# EAGLE design TinyCube11c_Lib (EAGLE 7.5.0)
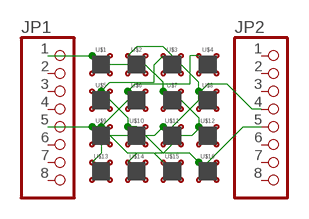
[diagram p0: schematic, sheet 1]

## Parts
JP1  PINHD-1X8BIG  [1X08-BIG]
JP2  PINHD-1X8BIG  [1X08-BIG]
U$1  PILLAR  [10MIL]
U$2  PILLAR  [10MIL]
U$3  PILLAR  [10MIL]
U$4  PILLAR  [10MIL]
U$5  PILLAR  [10MIL]
U$6  PILLAR  [10MIL]
U$7  PILLAR  [10MIL]
U$8  PILLAR  [10MIL]
U$9  PILLAR  [10MIL]
U$10  PILLAR  [10MIL]
U$11  PILLAR  [10MIL]
U$12  PILLAR  [10MIL]
U$13  PILLAR  [10MIL]
U$14  PILLAR  [10MIL]
U$15  PILLAR  [10MIL]
U$16  PILLAR  [10MIL]

## Nets
N$1: JP1.1 U$1.R(B) U$7.R(B) U$12.R(B) U$14.R(B)
N$2: JP2.4 U$2.R(B) U$8.R(B) U$11.R(B) U$13.R(B)
N$3: JP2.5 U$3.R(B) U$5.R(B) U$10.R(B) U$16.R(B)
N$5: JP1.5 U$4.R(B) U$6.R(B) U$9.R(B) U$15.R(B)
Unconnected: JP1.2 JP1.3 JP1.4 JP1.6 JP1.7 JP1.8 JP2.1 JP2.2 JP2.3 JP2.6 JP2.7 JP2.8 U$1.+(G) U$1.B(R) U$1.G(A) U$2.+(G) U$2.B(R) U$2.G(A) U$3.+(G) U$3.B(R) U$3.G(A) U$4.+(G) U$4.B(R) U$4.G(A) U$5.+(G) U$5.B(R) U$5.G(A) U$6.+(G) U$6.B(R) U$6.G(A) U$7.+(G) U$7.B(R) U$7.G(A) U$8.+(G) U$8.B(R) U$8.G(A) U$9.+(G) U$9.B(R) U$9.G(A) U$10.+(G) U$10.B(R) U$10.G(A) U$11.+(G) U$11.B(R) U$11.G(A) U$12.+(G) U$12.B(R) U$12.G(A) U$13.+(G) U$13.B(R) U$13.G(A) U$14.+(G) U$14.B(R) U$14.G(A) U$15.+(G) U$15.B(R) U$15.G(A) U$16.+(G) U$16.B(R) U$16.G(A)

## Library data of the parts
JP1 JP2 = adafruit:PINHD-1X8: PIN HEADER
U$1-U$16 = PILLAR:PILLAR

## Board
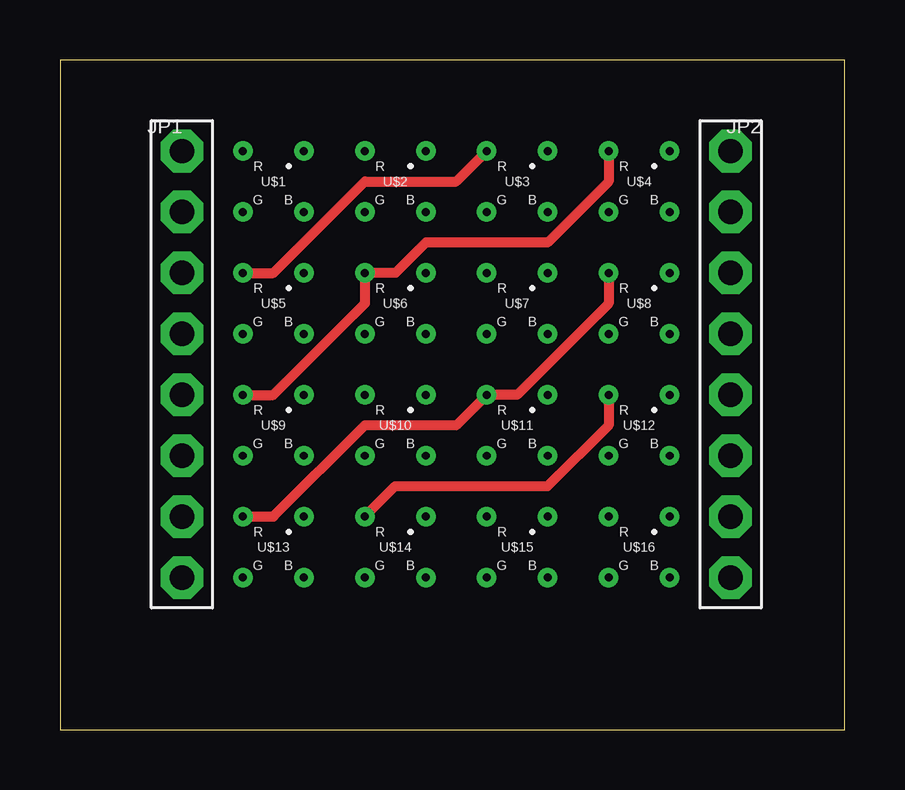
[diagram p1: board, top side]
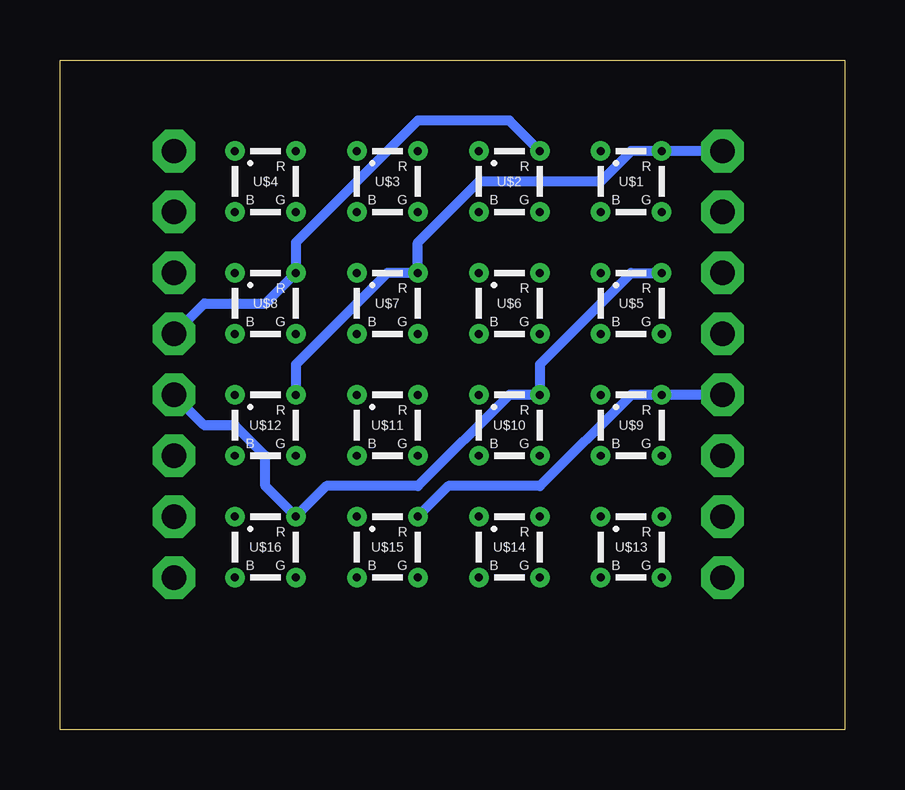
[diagram p2: board, bottom side, seen from below]

Size 32.69 x 27.93 mm. Coordinates in mm from the lower left corner, seen from the top.
Outline: 0,0 32.69,0 32.69,27.93 0,27.93 0,0
Copper layers (1*16): Top 0.0356mm / dielectric 1.5011mm / Bottom 0.0356mm
Design rules "LaenPCBOrder": minimum track width 6mil, minimum drill 13mil, track to track 6mil, track to pad 6mil, pad to pad 6mil, via to via 6mil, smd to smd 6mil, copper to edge 15mil, drill to drill 6mil, minimum pad ring 7mil, minimum via ring 7mil, stop-mask expansion 3mil, vias tented up to drill 0mil, thermal gap 10mil

### Footprints (pad centres in the part's own frame; a part is rotated, then mirrored left to right if it is on the bottom)
1X08-BIG = drill 1.016 pad 1.778 octagon: 1 -8.89,0; 2 -6.35,0; 3 -3.81,0; 4 -1.27,0; 5 1.27,0; 6 3.81,0; 7 6.35,0; 8 8.89,0
10MIL = drill 0.33 pad 0.813: + 1.27,1.27; B 1.27,-1.27; G -1.27,-1.27; R -1.27,1.27

### Placement (x,y rotation side)
JP1  5.08,15.24 270 top
JP2  27.94,15.24 270 top
U$1  8.89,22.86 0 top
U$2  13.97,22.86 0 top
U$3  19.05,22.86 0 top
U$4  24.13,22.86 0 top
U$5  8.89,17.78 0 top
U$6  13.97,17.78 0 top
U$7  19.05,17.78 0 top
U$8  24.13,17.78 0 top
U$9  8.89,12.7 0 top
U$10  13.97,12.7 0 top
U$11  19.05,12.7 0 top
U$12  24.13,12.7 0 top
U$13  8.89,7.62 0 top
U$14  13.97,7.62 0 top
U$15  19.05,7.62 0 top
U$16  24.13,7.62 0 top

### Tracks (layer width: path | path; a pad name or v marks a point on that pad's centre or on a via)
N$1
  Top 0.406: U$14.R 13.97,10.16 20.32,10.16 22.86,12.7 U$12.R
  Bottom 0.406: JP1.1 U$1.R 8.89,24.13 10.16,22.86 15.24,22.86 17.78,20.32 U$7.R 19.05,19.05 22.86,15.24 U$12.R
N$2
  Top 0.406: U$8.R 22.86,17.78 19.05,13.97 U$11.R 16.51,12.7 12.7,12.7 8.89,8.89 U$13.R
  Bottom 0.406: U$2.R 13.97,25.4 17.78,25.4 22.86,20.32 U$8.R 24.13,17.78 26.67,17.78 JP2.4
N$3
  Top 0.406: U$5.R 8.89,19.05 12.7,22.86 16.51,22.86 U$3.R
  Bottom 0.406: U$5.R 8.89,19.05 12.7,15.24 U$10.R 13.97,13.97 17.78,10.16 21.59,10.16 U$16.R 24.13,10.16 24.13,11.43 25.4,12.7 26.67,12.7 JP2.5
N$5
  Top 0.406: U$9.R 8.89,13.97 12.7,17.78 U$6.R 13.97,19.05 15.24,20.32 20.32,20.32 22.86,22.86 U$4.R
  Bottom 0.406: U$15.R 16.51,10.16 12.7,10.16 8.89,13.97 U$9.R JP1.5